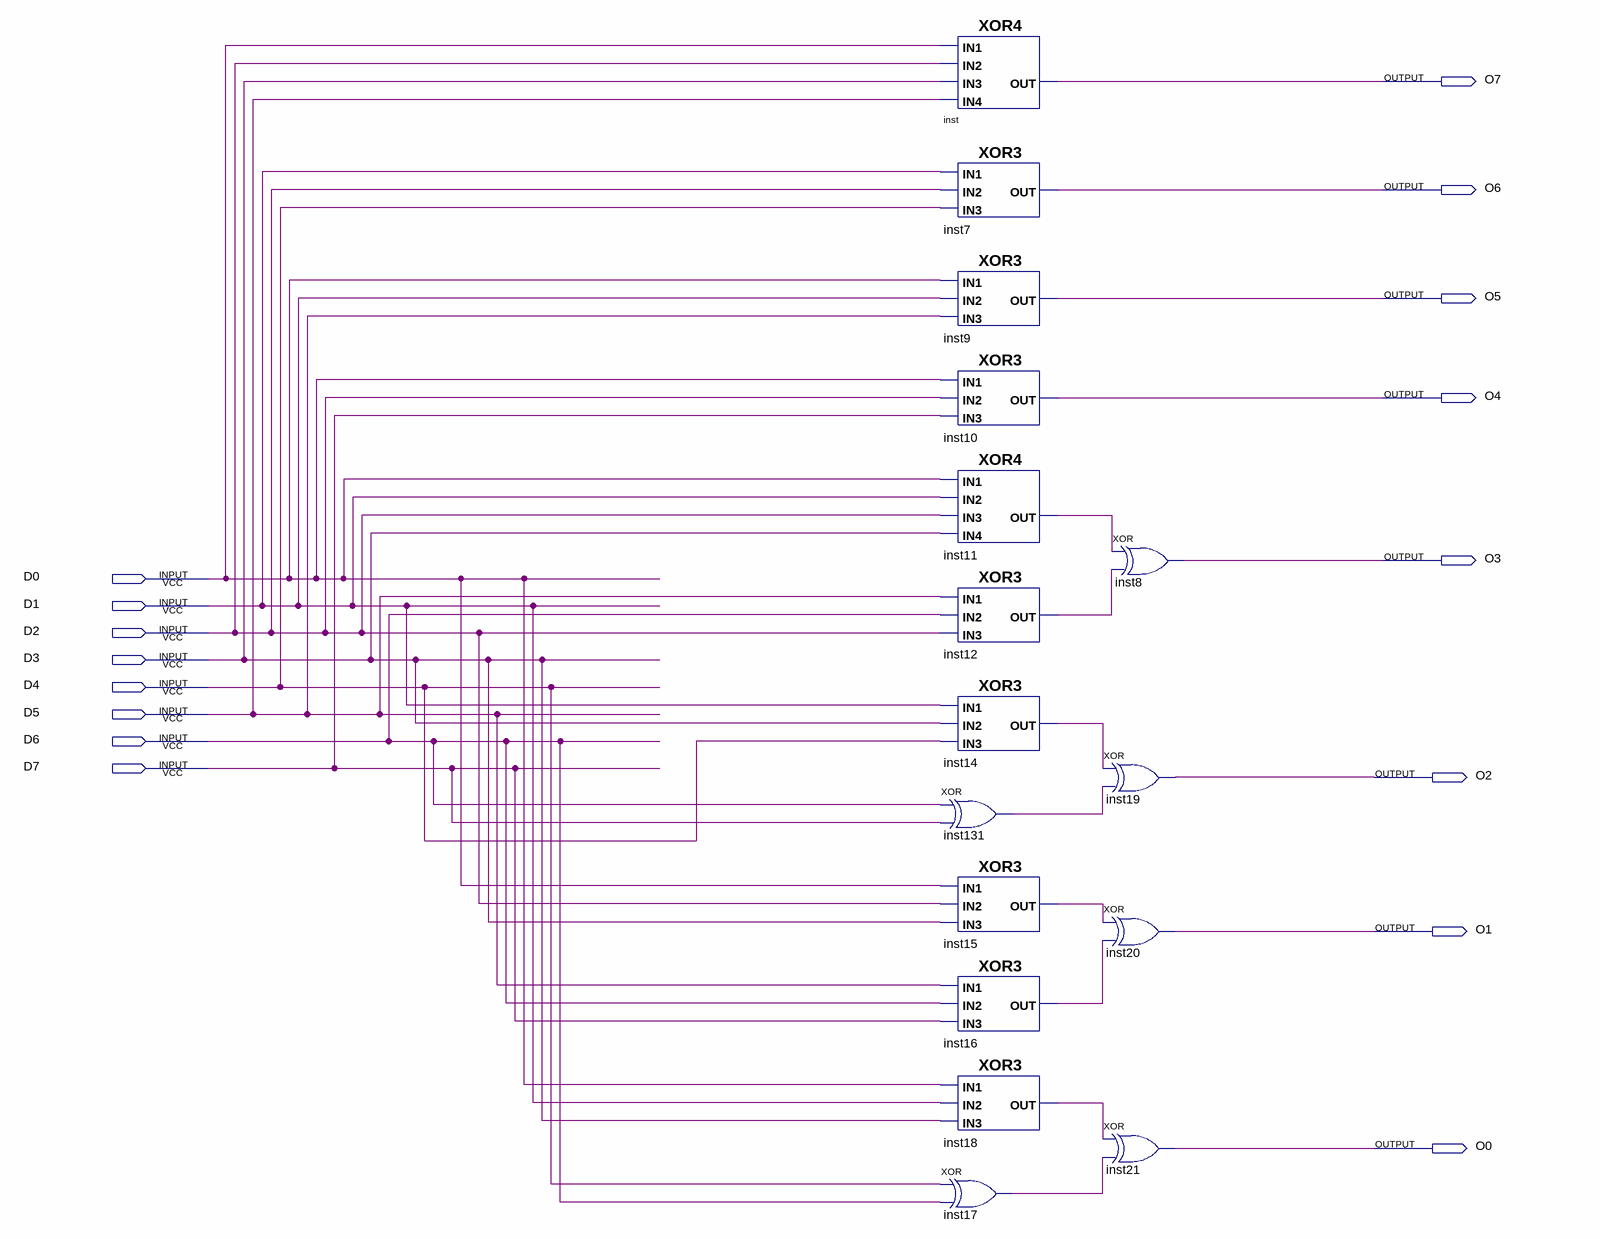
[diagram p0: schematic sheet]
// Quartus schematic gf256.bdf as structural Verilog: 16 symbols, 16 pins
module gf256 (
  input  D0,
  input  D1,
  input  D2,
  input  D3,
  input  D4,
  input  D5,
  input  D6,
  input  D7,
  output O7,
  output O6,
  output O5,
  output O4,
  output O3,
  output O2,
  output O1,
  output O0
);

  wire inst11_out, inst12_out, inst14_out, inst15_out, inst16_out, inst17_out, inst18_out, inst131_out;

  XOR4 inst (.IN3(D3), .IN4(D5), .IN2(D2), .IN1(D0), .OUT(O7));
  XOR3 inst7 (.IN3(D4), .IN1(D1), .IN2(D2), .OUT(O6));
  XOR3 inst9 (.IN3(D5), .IN1(D0), .IN2(D1), .OUT(O5));
  XOR3 inst10 (.IN3(D7), .IN1(D0), .IN2(D2), .OUT(O4));
  XOR4 inst11 (.IN3(D2), .IN4(D3), .IN2(D1), .IN1(D0), .OUT(inst11_out));
  XOR3 inst12 (.IN3(D2), .IN1(D5), .IN2(D6), .OUT(inst12_out));
  XOR3 inst14 (.IN3(D4), .IN1(D1), .IN2(D3), .OUT(inst14_out));
  xor inst131 (inst131_out, D6, D7);
  XOR3 inst15 (.IN3(D3), .IN1(D0), .IN2(D2), .OUT(inst15_out));
  XOR3 inst16 (.IN3(D7), .IN1(D5), .IN2(D6), .OUT(inst16_out));
  XOR3 inst18 (.IN3(D3), .IN1(D0), .IN2(D1), .OUT(inst18_out));
  xor inst17 (inst17_out, D4, D6);
  xor inst8 (O3, inst11_out, inst12_out);
  xor inst19 (O2, inst14_out, inst131_out);
  xor inst20 (O1, inst15_out, inst16_out);
  xor inst21 (O0, inst18_out, inst17_out);
endmodule
